# Altium schematic sheet programming.SchDoc: USB to UART and MCU programming
size A4; SheetNumber: 12; SheetTotal: 20; TitleBig: USB to UART and MCU programming; Desc_line1: This circuit allows a computer to the ESP32 via USB so it can be reprogrammed. This is possible by sending RTS; Desc_line2: and DTR signals with a determined timing so the device enters an alternative boot mode.
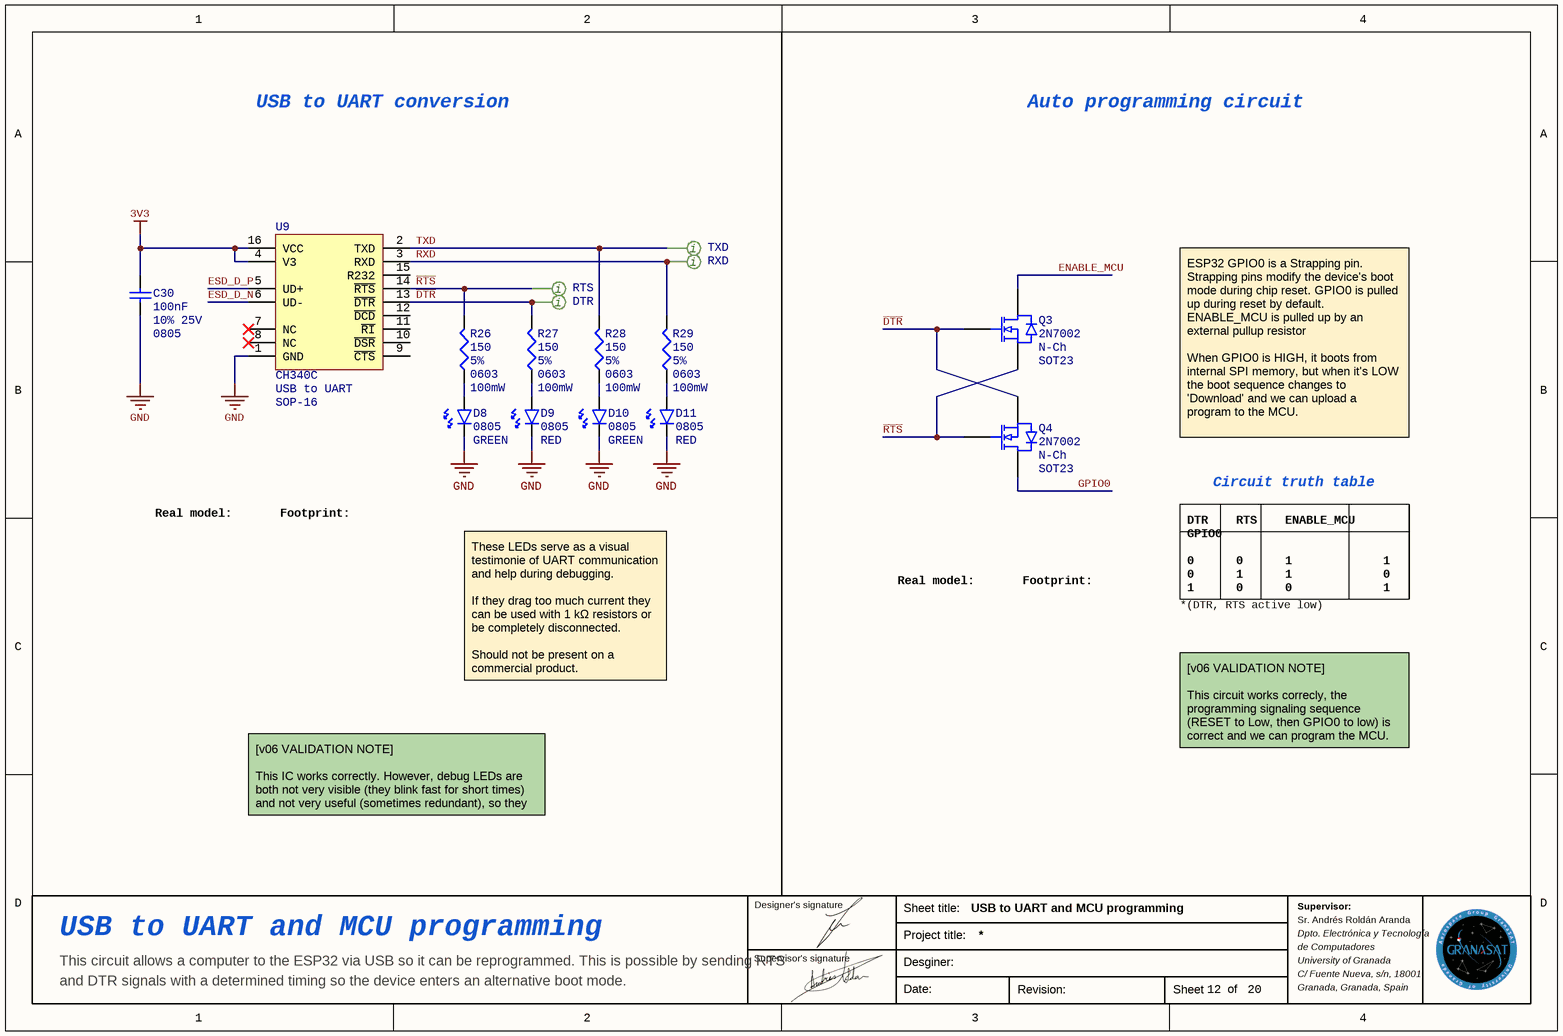
[diagram p0: programming.SchDoc]

## Parts
C30  value 100nF  Tolerance: 10% 25V  PackageDescription: 0805  [CAP 0805_2012]  (hidden comment: Cap_cer_0805)
D8  PackageDescription: 0805  Type: GREEN  [LED 0805_2012 GREEN]  (hidden comment: Diode LED_G_0805)
D9  PackageDescription: 0805  Type: RED  [LED 0805_2012 RED]  (hidden comment: Diode LED_R_0805)
D10  PackageDescription: 0805  Type: GREEN  [LED 0805_2012 GREEN]  (hidden comment: Diode LED_G_0805)
D11  PackageDescription: 0805  Type: RED  [LED 0805_2012 RED]  (hidden comment: Diode LED_R_0805)
DTR  Test Point Pad dual sided  [TEST POINT PAD]  (value not drawn)  (no BOM)
Q3  Part: 2N7002  Type: N-Ch  PackageDescription: SOT23  [SOT-23-3 TO-236AB 2N7002]  (hidden comment: NMOS 2N7002)
Q4  Part: 2N7002  Type: N-Ch  PackageDescription: SOT23  [SOT-23-3 TO-236AB 2N7002]  (hidden comment: NMOS 2N7002)
R26  value 150  Tolerance: 5%  PackageDescription: 0603  PowerDisipated: 100mW  [RES 0603_1608]  (hidden comment: Res_0603_150_5%_100mW)
R27  value 150  Tolerance: 5%  PackageDescription: 0603  PowerDisipated: 100mW  [RES 0603_1608]  (hidden comment: Res_0603_150_5%_100mW)
R28  value 150  Tolerance: 5%  PackageDescription: 0603  PowerDisipated: 100mW  [RES 0603_1608]  (hidden comment: Res_0603_150_5%_100mW)
R29  value 150  Tolerance: 5%  PackageDescription: 0603  PowerDisipated: 100mW  [RES 0603_1608]  (hidden comment: Res_0603_150_5%_100mW)
RTS  Test Point Pad dual sided  [TEST POINT PAD]  (value not drawn)  (no BOM)
RXD  Test Point Pad dual sided  [TEST POINT PAD]  (value not drawn)  (no BOM)
TXD  Test Point Pad dual sided  [TEST POINT PAD]  (value not drawn)  (no BOM)
U9  Type: USB to UART  PackageDescription: SOP-16  [SSOP-16 150mil CH340C]  (hidden comment: CH340C)

## Nets
3V3: C30.2 U9.4(V3) U9.16(VCC)
GND: C30.1 D8.2 D9.2 D10.2 D11.2 U9.1(GND)
~{DTR}: DTR.1 Q3.1(G) Q4.2(S) R27.2 U9.13(~{DTR})
ENABLE_MCU: Q3.3(D)
ESD_D_N: U9.6(UD-)
ESD_D_P: U9.5(UD+)
GPIO0: Q4.3(D)
~{RTS}: Q3.2(S) Q4.1(G) R26.2 RTS.1 U9.14(~{RTS})
RXD: R29.2 RXD.1 U9.3(RXD)
TXD: R28.2 TXD.1 U9.2(TXD)
NetD8_1: D8.1 R26.1
NetD9_1: D9.1 R27.1
NetD10_1: D10.1 R28.1
NetD11_1: D11.1 R29.1

Not connected (* = marked no-connect by the designer): U9 7(NC)* 8(NC)* 9(~{CTS}) 10(~{DSR}) 11(~{RI}) 12(~{DCD}) 15(R232)

## Notes on the sheet
- USB to UART conversion
- Auto programming circuit
- ESP32 GPIO0 is a Strapping pin. Strapping pins modify the device's boot mode during chip reset. GPIO0 is pulled up during reset by default. ENABLE_MCU is pulled up by an external pullup resistor
  When GPIO0 is HIGH, it boots from internal SPI memory, but when it's LOW the boot sequence changes to 'Download' and we can upload a program to the MCU.
  [ESP32 Datasheet, section 2.4, pages 19-20]
- Real model:
- Footprint:
- Circuit truth table
- DTR    RTS    ENABLE_MCU    GPIO0
  0      0      1             1
  0      1      1             0
  1      0      0             1
  1      1      1             1
- *(DTR, RTS active low)
- These LEDs serve as a visual testimonie of UART communication and help during debugging.
  If they drag too much current they can be used with 1 kΩ resistors or be completely disconnected.
  Should not be present on a commercial product.
- [v06 VALIDATION NOTE]
  This circuit works correcly, the programming signaling sequence (RESET to Low, then GPIO0 to low) is correct and we can program the MCU.
- [v06 VALIDATION NOTE]
  This IC works correctly. However, debug LEDs are both not very visible (they blink fast for short times) and not very useful (sometimes redundant), so they can be removed.
- Designer's signature
- Sheet title:
- Sr. Andrés Roldán Aranda
- Supervisor:
- Supervisor's signature
- Project title:
- Desginer:
- Dpto. Electrónica y Tecnología
- de Computadores
- University of Granada
- C/ Fuente Nueva, s/n, 18001
- Granada, Granada, Spain
- Date:
- Revision:
- Sheet
- of
- (in symbol Test Point Pad dual sided) i

## Library data of the parts
C30 = Cap_cer_0805_100nF_10%: Ceramic cap size 0805; FabGroup: USB to UART & Programming; FabOrder: 3
D8 D10 = Diode LED_G_0805: Low power LED color Green; FabGroup: USB to UART & Programming; FabOrder: 3
D9 D11 = Diode LED_R_0805: Low power LED color Red; FabGroup: USB to UART & Programming; FabOrder: 3
DTR RTS RXD TXD = Test Point Pad dual sided: Test point - PCB Pad dual sided
Q3 Q4 = NMOS 2N7002: FabGroup: USB to UART & Programming; FabOrder: 3; Value: *
R26-R29 = Res_0603_150_5%_100mW: Res size 0603 SMD mounting, low power
U9 = IC CH340C usb to ttl: USB to serial chip CH340C, integrated oscillator.; FabGroup: USB to UART & Programming; FabOrder: 3; Part: CH340C